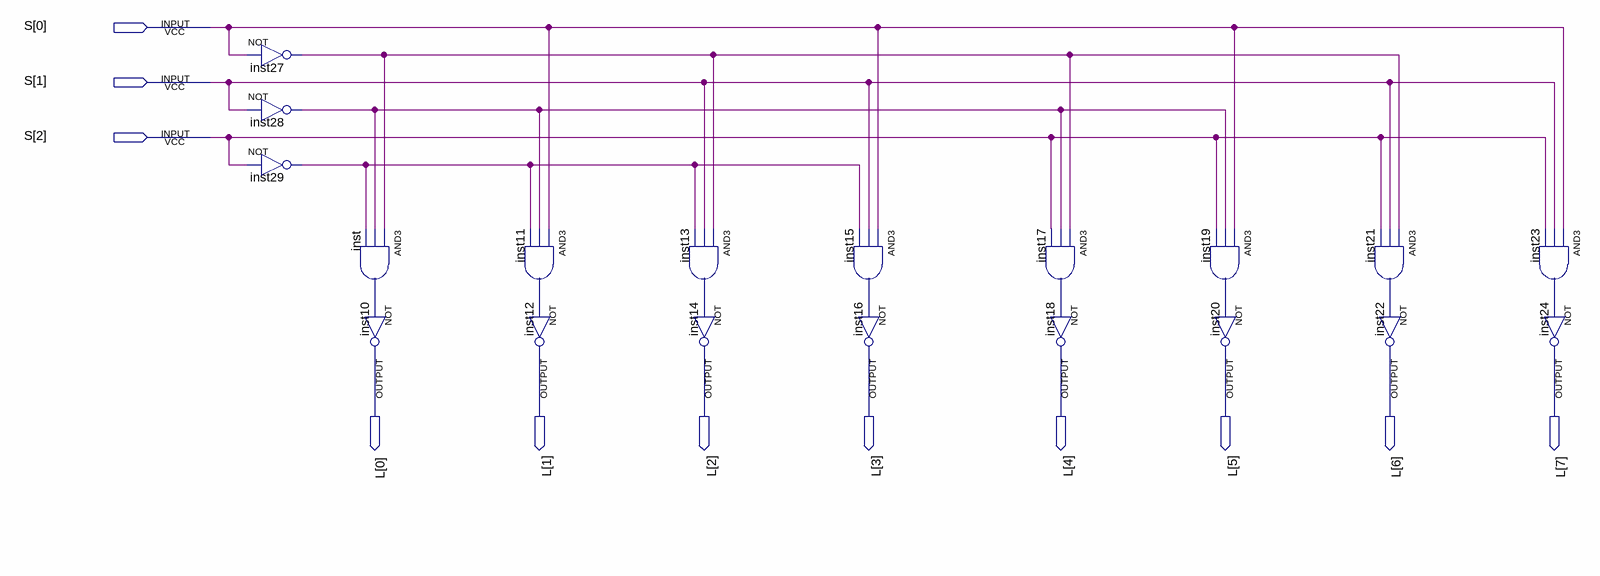
[diagram p0: schematic sheet]
// Quartus schematic linhas.bdf as structural Verilog: 19 symbols, 11 pins
module linhas (
  input  [2:0] S,
  output [7:0] L
);

  wire inst11_out, inst13_out, inst15_out, inst17_out, inst19_out, inst21_out, inst23_out, inst27_out,
       inst28_out, inst29_out, inst_out;

  not inst27 (inst27_out, S[0]);
  not inst28 (inst28_out, S[1]);
  not inst29 (inst29_out, S[2]);
  and inst (inst_out, inst27_out, inst28_out, inst29_out);
  not inst10 (L[0], inst_out);
  and inst11 (inst11_out, S[0], inst28_out, inst29_out);
  not inst12 (L[1], inst11_out);
  and inst13 (inst13_out, inst27_out, S[1], inst29_out);
  not inst14 (L[2], inst13_out);
  and inst15 (inst15_out, S[0], S[1], inst29_out);
  not inst16 (L[3], inst15_out);
  and inst17 (inst17_out, inst27_out, inst28_out, S[2]);
  not inst18 (L[4], inst17_out);
  and inst19 (inst19_out, S[0], inst28_out, S[2]);
  not inst20 (L[5], inst19_out);
  and inst21 (inst21_out, inst27_out, S[1], S[2]);
  not inst22 (L[6], inst21_out);
  and inst23 (inst23_out, S[0], S[1], S[2]);
  not inst24 (L[7], inst23_out);
endmodule
